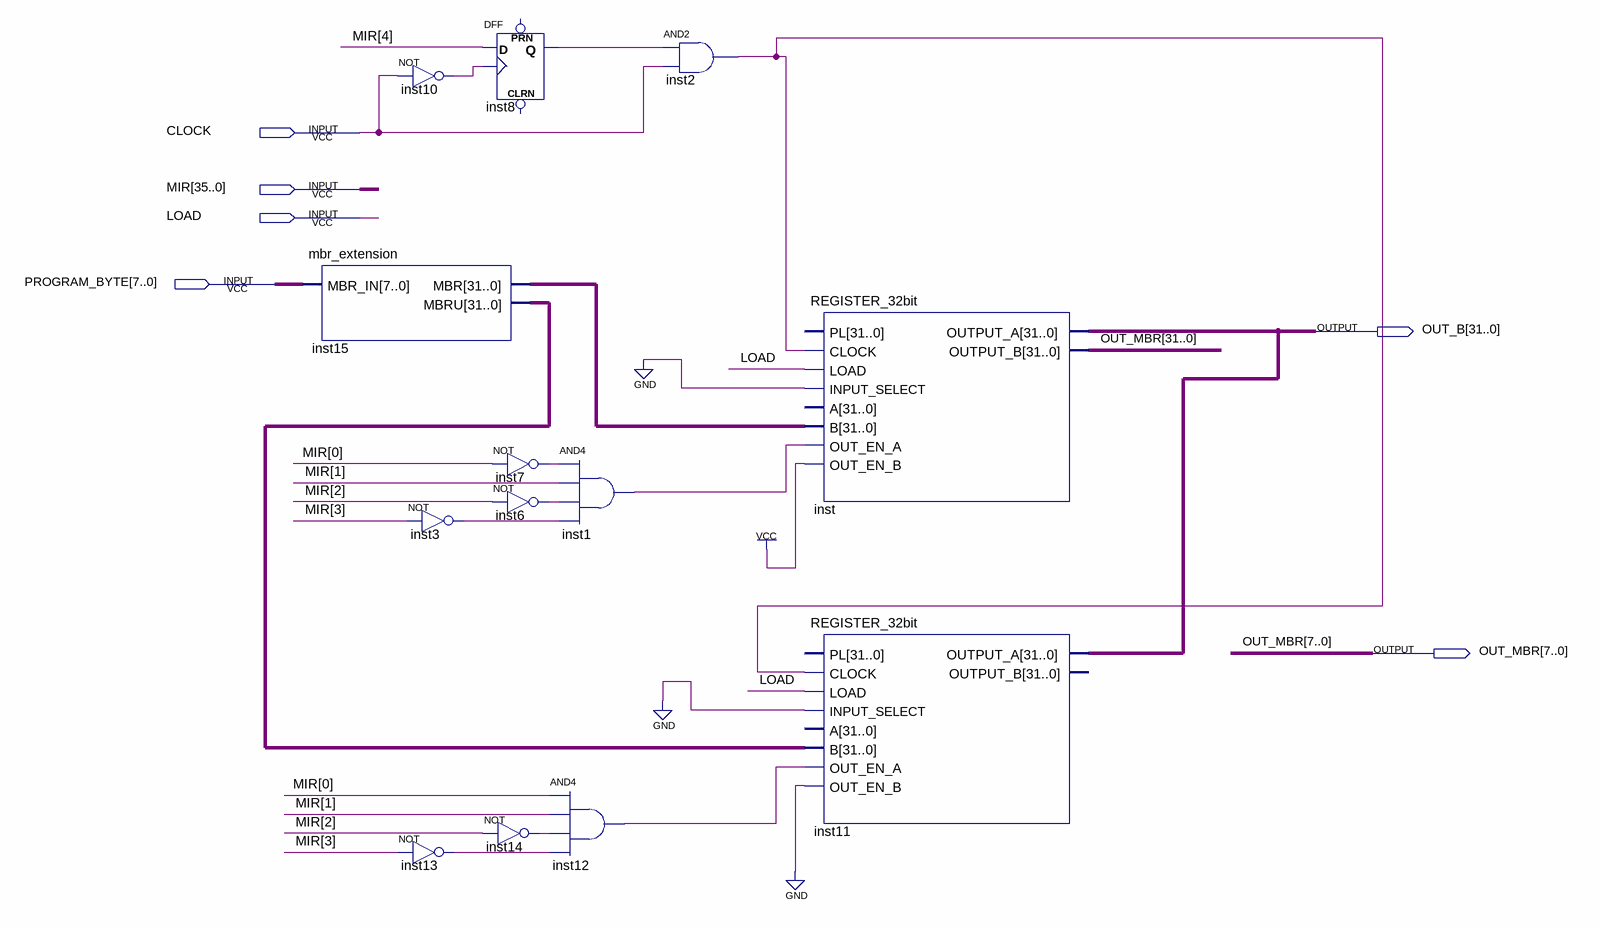
[diagram p0: schematic sheet]
// Quartus schematic MBR.bdf as structural Verilog: 13 symbols, 6 pins
module MBR (
  input  CLOCK,
  input  [35:0] MIR,
  input  LOAD,
  input  [7:0] PROGRAM_BYTE,
  output [31:0] OUT_B,
  output [31:0] OUT_MBR
);

  wire inst1_out, inst2_out, inst3_out, inst6_out, inst7_out, inst8_q, inst10_out, inst12_out, inst13_out,
       inst14_out;
  wire [31:0] inst15_mbr, inst15_mbru;

  mbr_extension inst15 (.MBR_IN(PROGRAM_BYTE), .MBR(inst15_mbr), .MBRU(inst15_mbru));
  not inst10 (inst10_out, CLOCK);
  not inst3 (inst3_out, MIR[3]);
  not inst13 (inst13_out, MIR[3]);
  DFF inst8 (.CLK(inst10_out), .D(MIR[4]), .Q(inst8_q));  // open: CLRN, PRN
  not inst7 (inst7_out, MIR[0]);
  not inst6 (inst6_out, MIR[2]);
  not inst14 (inst14_out, MIR[2]);
  and inst1 (inst1_out, inst7_out, MIR[1], inst6_out, inst3_out);
  and inst12 (inst12_out, MIR[0], MIR[1], inst14_out, inst13_out);
  and inst2 (inst2_out, inst8_q, CLOCK);
  REGISTER_32bit inst (
    .CLOCK(inst2_out), .LOAD(LOAD), .INPUT_SELECT(1'b0), .B(inst15_mbr), .OUT_EN_A(inst1_out),
    .OUT_EN_B(1'b1), .OUTPUT_A(OUT_B), .OUTPUT_B(OUT_MBR));  // open: PL, A
  REGISTER_32bit inst11 (
    .CLOCK(inst2_out), .LOAD(LOAD), .INPUT_SELECT(1'b0), .B(inst15_mbru), .OUT_EN_A(inst12_out),
    .OUT_EN_B(1'b0), .OUTPUT_A(OUT_B));  // open: PL, A, OUTPUT_B
endmodule
